# EAGLE design Exp_Board_Slolu (EAGLE 6.2)
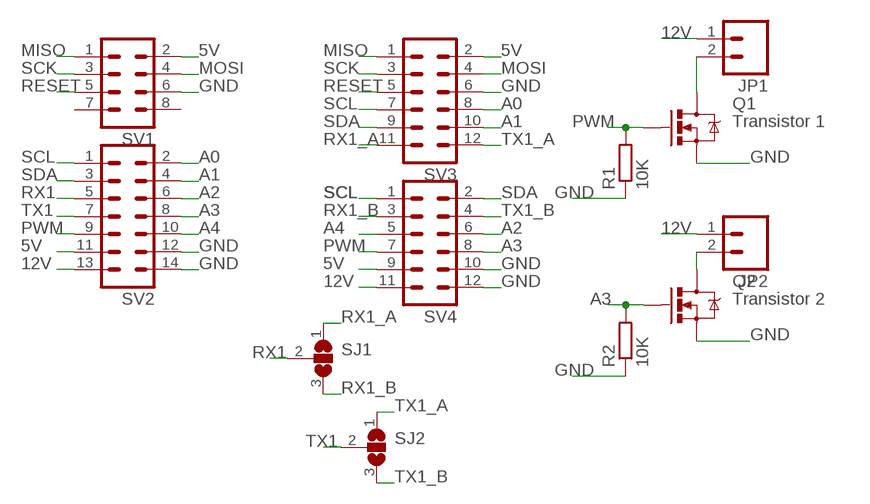
[diagram p0: schematic, sheet 1]

## Parts
JP1  M02PTH  [1X02]
JP2  M02PTH  [1X02]
Q1  Transistor 1  MOSFET-NCHANNELPTH2  [TO220V]
Q2  Transistor 2  MOSFET-NCHANNELPTH2  [TO220V]
R1  10K  R-EU_0204/7  [0204/7]
R2  10K  R-EU_0204/7  [0204/7]
SJ1  SJ2W  [SJ_2]
SJ2  SJ2W  [SJ_2]
SV1  MA04-2  [MA04-2]
SV2  MA07-2  [MA07-2]
SV3  MA06-2  [MA06-2]
SV4  MA06-2  [MA06-2]

## Nets
5V: SV1.2 SV2.11 SV3.2 SV4.9
12V: JP1.1 JP2.1 SV2.13 SV4.11
A0: SV2.2 SV3.8
A1: SV2.4 SV3.10
A2: SV2.6 SV4.6
A3: Q2.1(G) R2.2 SV2.8 SV4.8
A4: SV2.10 SV4.5
GND: Q1.3(S) Q2.3(S) R1.1 R2.1 SV1.6 SV2.12 SV2.14 SV3.6 SV4.10 SV4.12
MISO: SV1.1 SV3.1
MOSI: SV1.4 SV3.4
N$1: JP1.2 Q1.2(D)
N$2: JP2.2 Q2.2(D)
PWM: Q1.1(G) R1.2 SV2.9 SV4.7
RESET: SV1.5 SV3.5
RX1: SJ1.2 SV2.5
RX1_A: SJ1.1 SV3.11
RX1_B: SJ1.3 SV4.3
SCK: SV1.3 SV3.3
SCL: SV2.1 SV3.7 SV4.1
SDA: SV2.3 SV3.9 SV4.2
TX1: SJ2.2 SV2.7
TX1_A: SJ2.1 SV3.12
TX1_B: SJ2.3 SV4.4
Unconnected: SV1.7 SV1.8

## Library data of the parts
JP1 JP2 = SparkFun-Connectors:M02: Header 2 Standard 2-pin 0.1" header. Use with straight break away headers (SKU : PRT-00116), right angle break away headers (PRT-00553), swiss pins (PRT-00743), machine pins (PRT-00117), and female headers (PRT-00115). Molex polarized connector foot print use with SKU : PRT-08233 with associated crimp pins and housings.
Q1 Q2 = SparkFun-DiscreteSemi:MOSFET-NCHANNEL: Generic NMOS footprint
R1 R2 = resistor:R-EU_: RESISTOR, European symbol
SJ1 SJ2 = jumper:SJ2W: SMD solder JUMPER
SV1 = con-lstb:MA04-2: PIN HEADER; OC_FARNELL: unknown; OC_NEWARK: unknown
SV2 = con-lstb:MA07-2: PIN HEADER; OC_FARNELL: unknown; OC_NEWARK: unknown
SV3 SV4 = con-lstb:MA06-2: PIN HEADER; OC_FARNELL: unknown; OC_NEWARK: unknown

## Board
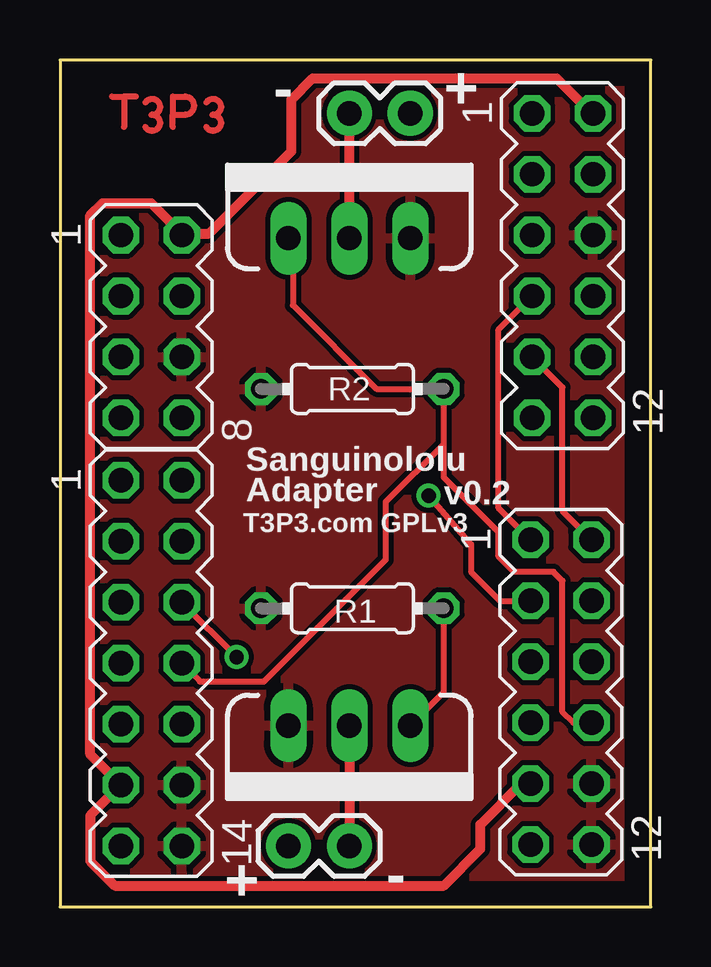
[diagram p1: board, top side]
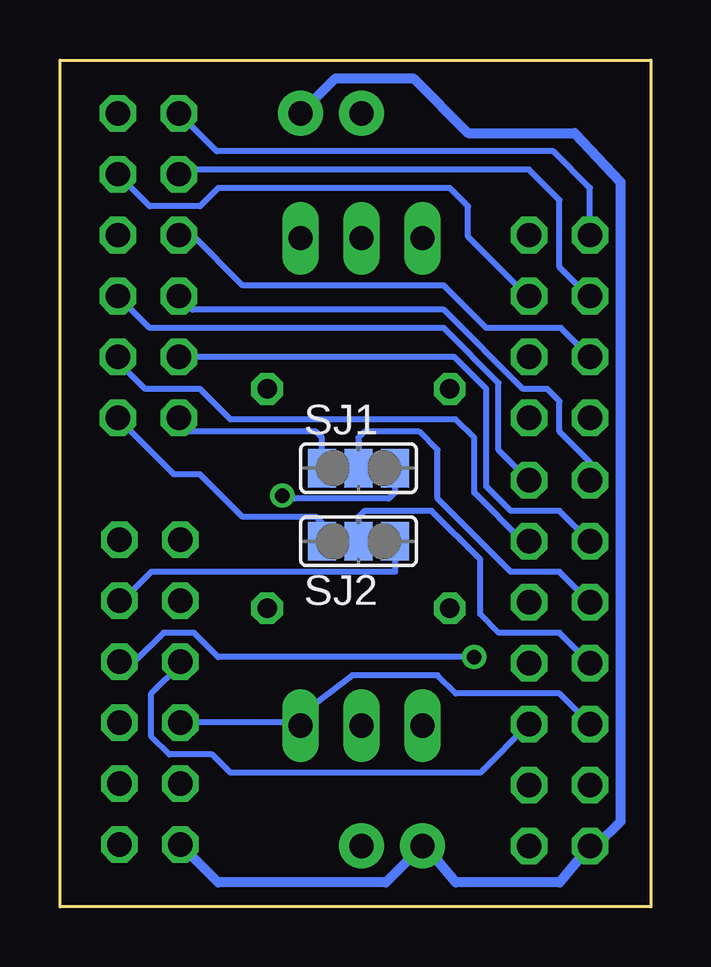
[diagram p2: board, bottom side, seen from below]

Size 24.64 x 35.31 mm. Coordinates in mm from the lower left corner, seen from the top.
Outline: 0,0 24.64,0 24.64,35.31 0,35.31 0,0
Copper layers (1*16): Top 0.035mm / dielectric 1.5mm / Bottom 0.035mm
Design rules: minimum track width 10mil, minimum drill 24mil, track to track 8mil, track to pad 8mil, pad to pad 8mil, via to via 8mil, smd to smd 8mil, copper to edge 40mil, drill to drill 8mil, minimum pad ring 10mil, minimum via ring 8mil, stop-mask expansion 4mil, vias tented up to drill 0mil, thermal gap 10mil

### Footprints (pad centres in the part's own frame; a part is rotated, then mirrored left to right if it is on the bottom)
1X02 = drill 1.016 pad 1.88: 1 0,0; 2 2.54,0
TO220V = drill 1.016 long: 1 -2.54,0; 2 0,0; 3 2.54,0
0204/7 = drill 0.813 octagon: 1 -3.81,0; 2 3.81,0
SJ_2 = smd 1.168 x 1.6: 1 -1.524,0; 2 0,0; 3 1.524,0
MA04-2 = drill 1.016 octagon: 1 -3.81,-1.27; 2 -3.81,1.27; 3 -1.27,-1.27; 4 -1.27,1.27; 5 1.27,-1.27; 6 1.27,1.27; 7 3.81,-1.27; 8 3.81,1.27
MA07-2 = drill 1.016 octagon: 1 -7.62,-1.27; 2 -7.62,1.27; 3 -5.08,-1.27; 4 -5.08,1.27; 5 -2.54,-1.27; 6 -2.54,1.27; 7 0,-1.27; 8 0,1.27; 9 2.54,-1.27; 10 2.54,1.27; 11 5.08,-1.27; 12 5.08,1.27; 13 7.62,-1.27; 14 7.62,1.27
MA06-2 = drill 1.016 octagon: 1 -6.35,-1.27; 2 -6.35,1.27; 3 -3.81,-1.27; 4 -3.81,1.27; 5 -1.27,-1.27; 6 -1.27,1.27; 7 1.27,-1.27; 8 1.27,1.27; 9 3.81,-1.27; 10 3.81,1.27; 11 6.35,-1.27; 12 6.35,1.27

### Placement (x,y rotation side)
JP1  9.53,2.54 0 top
JP2  14.61,33.08 180 top
Q1  12.06,7.56 180 top
Q2  12.06,27.88 0 top
R1  12.19,12.45 0 top
R2  12.19,21.59 0 top
SJ1  12.19,18.29 0 bottom
SJ2  12.19,15.24 0 bottom
SV1  3.81,24.19 270 top
SV2  3.81,10.16 270 top
SV3  20.95,26.73 270 top
SV4  20.89,8.95 270 top

### Tracks (layer width: path | path; a pad name or v marks a point on that pad's centre or on a via)
5V
  Top 0.406: SV4.9 19.24,5.14 17.53,3.43 17.53,2.41 16,0.89 2.29,0.89 1.27,1.91 1.27,3.81 SV2.11 1.27,6.35 1.27,28.83 1.78,29.34 3.81,29.34 5.08,28.07 SV1.2 5.14,28.07 6.22,28.07 9.65,31.5 9.65,33.66 10.54,34.54 20.7,34.54 22.16,33.08 SV3.2
12V
  Bottom 0.406: SV4.11 18.03,1.02 11.05,1.02 JP1.1 9.4,2.54 8.13,1.02 3.81,1.02 SV2.13 2.29,2.54 1.27,3.56 1.27,30.23 3.17,32.26 7.62,32.26 9.91,34.54 13.14,34.54 JP2.1
A0
  Bottom 0.254: SV3.8 20.89,24.13 8.64,24.13 6.35,21.84 6.35,19.05 SV2.2
A1
  Bottom 0.254: SV3.10 22.23,22.73 21.08,21.59 18.8,21.59 17.53,20.32 8.13,20.32 7.37,19.56 7.37,17.27 5.33,15.24 SV2.4
A2  (via drill 0.6)
  Top 0.254: SV2.6 v7.37,10.41
  Bottom 0.254: SV4.6 21.53,10.22 20.32,11.43 19.05,11.43 18.03,10.41 v7.37,10.41
A3
  Top 0.254: Q2.1 9.72,27.88 9.72,25.08 13.21,21.59 R2.2 16,19.3 | SV4.8 21.4,7.68 20.95,8.13 20.95,13.59 20.57,13.97 18.92,13.97 18.29,14.61 18.29,15.62 16,17.91 16,19.3 | SV2.8 5.84,9.4 8.51,9.4 13.59,14.48 13.59,16.89 16,19.3
A4
  Bottom 0.254: SV2.10 7.11,5.59 17.53,5.59 18.29,6.35 20.07,6.35 20.83,7.11 20.83,8.89 19.62,10.1 SV4.5
GND
  pour Top: 0,35.31 0,0 24.64,0 24.64,35.31
MISO
  Bottom 0.254: SV1.1 2.54,29.97 4.06,31.5 18.1,31.5 SV3.1
MOSI
  Bottom 0.254: SV1.4 5.14,25.46 7.62,27.94 7.62,29.21 8.38,29.97 18.03,29.97 18.8,29.21 20.89,29.21 SV3.4
N$1
  Top 0.406: Q1.2 JP1.2
N$2
  Top 0.406: Q2.2 JP2.2
N$3
  Top 0.254: 2.16,33.78 2.67,33.78 | 3.17,33.78 2.67,33.78 | 2.67,33.78 2.67,32.51
N$6
  Top 0.254: 4.7,33.02 4.7,33.78 5.21,33.78 arc-180 5.21,33.02 4.7,33.02 | 4.7,32.51 4.7,33.02
N$7
  Top 0.254: 3.56,32.51 arc243 3.81,33.02 arc243 3.56,33.53
N$11
  Top 0.254: 6.1,32.51 arc243 6.35,33.02 arc243 6.1,33.53
PWM
  Top 0.254: Q1.1 16,8.95 R1.2
  Bottom 0.254: SV2.9 3.81,8.89 8.13,8.89 8.89,9.65 12.45,9.65 14.61,8 Q1.1 14.73,7.68 SV4.7
RESET
  Bottom 0.254: SV1.5 3.75,24.13 6.86,24.13 8.64,25.91 17.02,25.91 19.11,28 SV3.5
RX1
  Bottom 0.254: SV2.5 3.81,13.97 5.84,13.97 8.89,17.02 8.89,19.05 9.65,19.81 11.94,19.81 12.19,19.56 SJ1.2
RX1_A
  Bottom 0.254: SJ1.1 13.72,19.56 13.97,19.81 19.3,19.81 19.68,20.19 SV3.11
RX1_B  (via drill 0.6)
  Top 0.254: v15.37,17.14 17.14,15.11 17.14,13.97 18.35,12.76 SV4.3
  Bottom 0.254: SJ1.3 10.67,17.27 10.92,17.02 14.86,17.02 14.99,17.14 v15.37,17.14
SCK
  Bottom 0.254: SV1.3 2.6,25.46 3.81,26.67 3.81,29.46 5.08,30.73 19.49,30.73 SV3.3
SCL
  Top 0.254: SV4.1 18.29,16.64 18.29,24.07 SV3.7
  Bottom 0.254: SV3.7 19.11,24.89 8.64,24.89 5.33,21.59 4.32,21.59 3.81,21.08 3.81,19.81 2.54,18.54 SV2.1
SDA
  Top 0.254: SV4.2 20.95,16.51 20.95,21.65 SV3.9
  Bottom 0.254: SV2.3 3.81,16.51 5.84,16.51 6.86,17.53 6.86,21.59 8.19,22.92 SV3.9
TX1
  Bottom 0.254: SV2.7 3.81,11.43 6.35,11.43 7.11,12.19 7.11,14.48 9.14,16.51 11.94,16.51 12.19,16.26 SJ2.2
TX1_A
  Bottom 0.254: SJ2.1 13.72,16 13.97,16.26 17.02,16.26 18.8,18.03 19.88,18.03 SV3.12
TX1_B
  Bottom 0.254: SJ2.3 10.67,13.97 20.83,13.97 22.04,12.76 SV4.4

### Text on the board
tPlace: - | + | Sanguinololu | Adapter | v0.2 | T3P3.com GPLv3 | - | +